# Altium schematic sheet PWR.SchDoc
size A
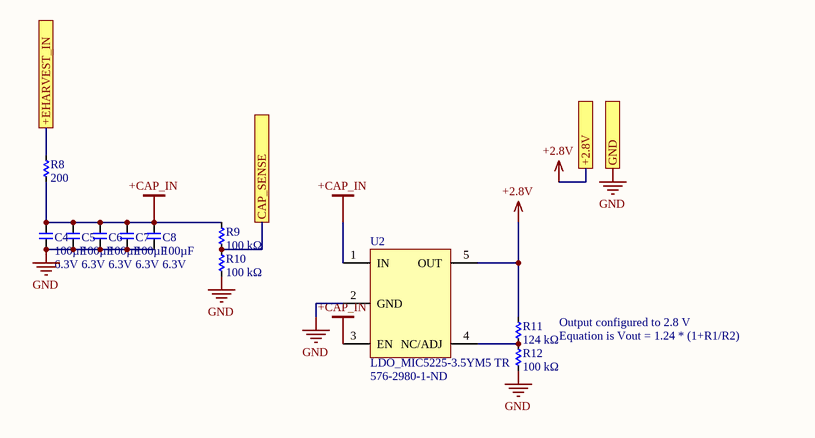
[diagram p0: PWR.SchDoc]

## Parts
C4  Capacitance: 100µF  Voltage - Rated: 6.3V  [C1206]  (hidden comment: CAP_100UF_1206_SMD)
C5  Capacitance: 100µF  Voltage - Rated: 6.3V  [C1206]  (hidden comment: CAP_100UF_1206_SMD)
C6  Capacitance: 100µF  Voltage - Rated: 6.3V  [C1206]  (hidden comment: CAP_100UF_1206_SMD)
C7  Capacitance: 100µF  Voltage - Rated: 6.3V  [C1206]  (hidden comment: CAP_100UF_1206_SMD)
C8  Capacitance: 100µF  Voltage - Rated: 6.3V  [C1206]  (hidden comment: CAP_100UF_1206_SMD)
R8  value 200  [R1206]  (hidden comment: __template_resistor)
R9  Resistance: 100 kΩ  [R0805]  (hidden comment: __template_resistor)
R10  Resistance: 100 kΩ  [R0805]  (hidden comment: __template_resistor)
R11  Resistance: 124 kΩ  [R0805]  (hidden comment: __template_resistor)
R12  Resistance: 100 kΩ  [R0805]  (hidden comment: __template_resistor)
U2  LDO_MIC5225-3.5YM5 TR  Supplier Part Number 1: 576-2980-1-ND  [5SOT23]

## Ports
+2.8V, +EHARVEST_IN, CAP_SENSE, GND

## Nets
+2.8V: R11.2 U2.5(OUT) ; port +2.8V
+CAP_IN: C4.1 C5.1 C6.1 C7.1 C8.1 R8.1 R9.2 U2.1(IN) U2.3(EN)
GND: C4.2 C5.2 C6.2 C7.2 C8.2 R10.1 R12.2 U2.2(GND) ; port GND
+EHARVEST_IN: R8.2 ; port +EHARVEST_IN
CAP_SENSE: R9.1 R10.2 ; port CAP_SENSE
NetR11_1: R11.1 R12.1 U2.4(NC/ADJ)

## Notes on the sheet
- Output configured to 2.8 V
- Equation is Vout = 1.24 * (1+R1/R2)

## Library data of the parts
C4-C8 = CAP_100UF_1206_SMD: 100UF SMD CAP CERAMIC; Manufacturer: Murata Electronics North America; Manufacturer Part Number: GRM31CD80J107ME39L; Tolerance: ±20%; Temperature Coefficient: X6T; Supplier 1: Digi-Key; RoHS: RoHS Compliant; Category: Capacitors; Stock 1: 406964; Pricing 1: 1=0.55, 10=0.388, 25=0.3308, 50=0.2932, 100=0.2553, 250=0.21748, 500=0.1891, 1000=0.16074 (USD); Packaging: Cut Tape (CT); Part Status: Active; Operating Temperature: -55°C ~ 105°C; Features: Derating Recommended; Ratings: -; Applications: General Purpose; Mounting Type: Surface Mount, MLCC; Package / Case: 1206 (3216 Metric); Size / Dimension: 0.126" L x 0.063" W (3.20mm x 1.60mm); Height - Seated (Max): -; Thickness (Max): 0.071" (1.80mm); Lead Spacing: -; Lead Style: -; ComponentLink1URL: http://www.murata.com/~/media/webrenewal/support/library/catalog/products/capacitor/mlcc/c02e.ashx; ComponentLink1Description: http://www.murata.com/~/media/webrenewal/support/library/catalog/products/capacitor/mlcc/c02e.ashx; Supplier Part Number 1: 490-10525-1-ND
R8 = RES SMD 200 OHM 1% 1/4W 1206: Manufacturer Part Number: CRCW1206200RFKEA; Manufacturer: Vishay Dale; Resistance (Machine readable): 200.00; Unit Price (USD): 0.102; Tolerance: ±1%; Power (Watts): 0.25W, 1/4W; Supplier Part Number: 541-200FCT-ND; type: resistor; Supplier 1: Digikey; Supplier Part Number 1: 541-200FCT-ND; Supplier 2: Mouser; Supplier Part Number 2: 71-CRCW1206-200-E3; Packaging: Cut Tape (CT); Series: CRCW; Package: 1206 (3216 Metric); Mouser PN Opt 1: 71-CRCW1206200RFKEA; Mouser PN Opt 2: 71-CRCW1206-200-E3
R9 R10 R12 = RES SMD 100K OHM 1% 1/8W 0805: Manufacturer Part Number: RC0805FR-07100KL; Manufacturer: Yageo; Resistance (Sortable): 100000; Tolerance: ±1%; Power (Watts): 0.125W, 1/8W; Temperature Coefficient: ±100ppm/°C; Supplier 1: Digikey; Datasheets: http://www.yageo.com/documents/recent/PYu-RC_Group_51_RoHS_L_9.pdf; Image: //media.digikey.com/Renders/Yageo%20Renders/0805-(2012-Metric).jpg; Supplier Part Number 1: 311-100KCRCT-ND; Operating Temperature: -55°C ~ 155°C
R11 = RES SMD 124K OHM 1% 1/8W 0805: Manufacturer Part Number: RC0805FR-07124KL; Manufacturer: Yageo; Resistance (Sortable): 124000; Tolerance: ±1%; Power (Watts): 0.125W, 1/8W; Temperature Coefficient: ±100ppm/°C; Supplier 1: Digikey; Datasheets: http://www.yageo.com/documents/recent/PYu-RC_Group_51_RoHS_L_9.pdf; Image: //media.digikey.com/Renders/Yageo%20Renders/0805-(2012-Metric).jpg; Supplier Part Number 1: 311-124KCRCT-ND; Operating Temperature: -55°C ~ 155°C
U2 = LDO_MIC5225-3.5YM5 TR: IC REG LINEAR 3.3V 150MA SOT23-5; Manufacturer: Microchip Technology; Manufacturer Part Number: MIC5225-3.3YM5-TR; Output Configuration: Positive; Output Type: Fixed; Voltage - Input (Max): 16V; Voltage Dropout (Max): 0.45V @ 150mA; Control Features: Enable; Protection Features: Over Current, Over Temperature, Reverse Polarity; Supplier 1: Digi-Key; RoHS: RoHS Compliant; Category: Integrated Circuits (ICs); Stock 1: 14087; Pricing 1: 1=0.41, 25=0.3392, 100=0.3074 (USD); Packaging: Cut Tape (CT); Part Status: Active; Voltage - Output (Min/Fixed): 3.3V; Voltage - Output (Max): -; Current - Output: 150mA; PSRR: -; Operating Temperature: -40°C ~ 125°C; Mounting Type: Surface Mount; Package / Case: SC-74A, SOT-753; Supplier Device Package: SOT-23-5; Base Part Number: MIC5225; ComponentLink1URL: http://www.microchip.com/mymicrochip/filehandler.aspx?ddocname=en579718; ComponentLink1Description: http://www.microchip.com/mymicrochip/filehandler.aspx?ddocname=en579718